# Altium schematic sheet [10]-POWER.SchDoc
size A4; Organization: Altium Limited; Address1: L3, 12a Rodborough Rd; Address2: Frenchs Forest; Address3: NSW; Address4: Australia 2086
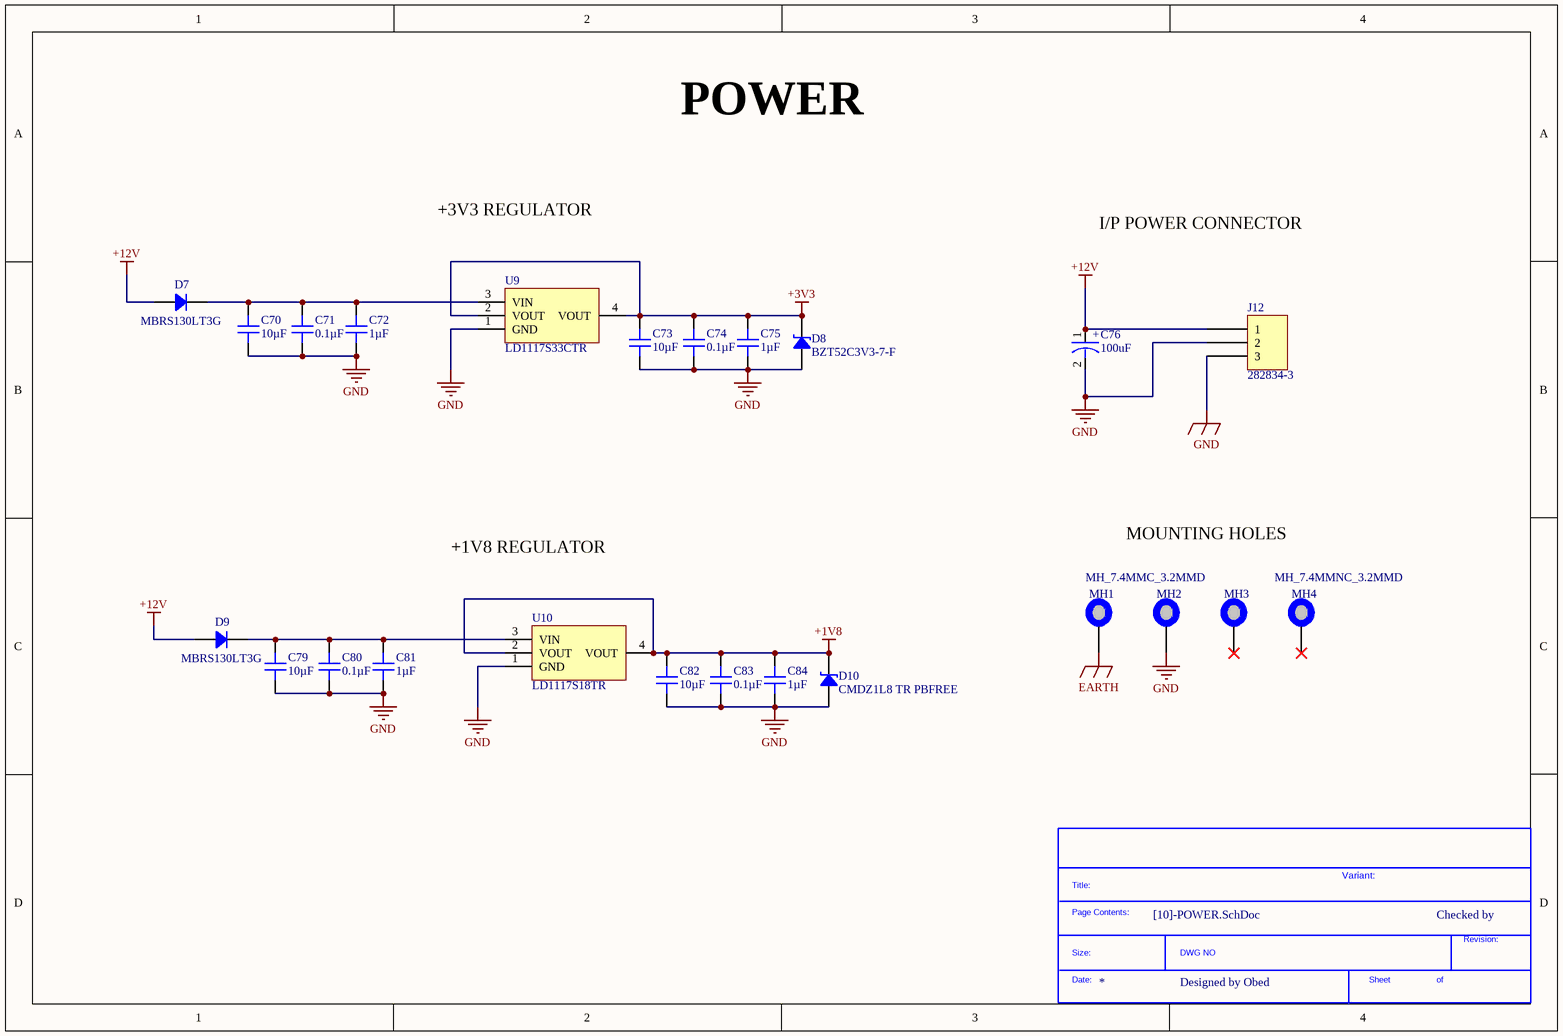
[diagram p0: [10]-POWER.SchDoc]

## Parts
*?  SDTitleBlock  (value not drawn)  (graphical)
C70  10µF  [CAP 1206_3216 - 1.8MM]
C71  0.1µF  [CAP 0805_2012]
C72  1µF  [CAP 0805_2012]
C73  10µF  [CAP 1206_3216 - 1.8MM]
C74  0.1µF  [CAP 0805_2012]
C75  1µF  [CAP 0805_2012]
C76  100uF  [ACAP_P305_D393_H393_RAD]
C79  10µF  [CAP 1206_3216 - 1.8MM]
C80  0.1µF  [CAP 0805_2012]
C81  1µF  [CAP 0805_2012]
C82  10µF  [CAP 1206_3216 - 1.8MM]
C83  0.1µF  [CAP 0805_2012]
C84  1µF  [CAP 0805_2012]
D7  MBRS130LT3G  [DO214AA SMB]
D8  BZT52C3V3-7-F  [SOD-123]
D9  MBRS130LT3G  [DO214AA SMB]
D10  CMDZ1L8 TR PBFREE  [SOD323]
J12  282834-3  [TE 282834-3]
MH1  MH_7.4MMC_3.2MMD  [MH_7.4MMC_3.2MMD]
MH2  MH_7.4MMC_3.2MMD  [MH_7.4MMC_3.2MMD]  (value not drawn)
MH3  MH_7.4MMC_3.2MMD  [MH_7.4MMC_3.2MMD]  (value not drawn)
MH4  MH_7.4MMNC_3.2MMD  [MH_7.4MM_3.2MMD_NON_COPPER_NPTH]
U9  LD1117S33CTR  [SOT223_3]
U10  LD1117S18TR  [SOT223_3]

## Nets
+1V8: C82.2 C83.1 C84.2 D10.2 U10.2(VOUT) U10.4(VOUT)
+3V3: C73.2 C74.1 C75.2 D8.2 U9.2(VOUT) U9.4(VOUT)
+12V: C76.1 D7.1 D9.1 J12.1
EARTH: MH1.1
GND: C70.1 C71.2 C72.1 C73.1 C74.2 C75.1 C76.2 C79.1 C80.2 C81.1 C82.1 C83.2 C84.1 D8.1 D10.1 J12.2 J12.3 MH2.1 U9.1(GND) U10.1(GND)
NetC70_2: C70.2 C71.1 C72.2 D7.2 U9.3(VIN)
NetC79_2: C79.2 C80.1 C81.2 D9.2 U10.3(VIN)

Not connected (* = marked no-connect by the designer): MH3 1*; MH4 1*

## Notes on the sheet
- POWER
- +3V3 REGULATOR
- I/P POWER CONNECTOR
- +1V8 REGULATOR
- MOUNTING HOLES
- Variant:
- Checked by
- Designed by Obed
- Title
- Size:
- Date:
- A4
- Number:
- Time:
- Revision:
- Sheet
- of
- File:
- (in symbol CAP-P_100uF-50V-20%-RAD) +
- (in symbol SDTitleBlock) Title:; Page Contents:; Revision:; Size:; DWG NO; Date:; Sheet; of

## Library data of the parts
C70 C73 C79 C82 = 12065D106KAT2A: CAP CER 10UF 50V X5R 1206; Manufacturer: AVX Corporation; Tolerance: ±10%; Part Number: 12065D106KAT2A; Value: 10µF; Applications: General Purpose; Capacitance: 10µF; ComponentLink1Description: Datasheet; ComponentLink1URL: http://datasheets.avx.com/cx5r.pdf; ComponentLink2Description: DigiKey Link; ComponentLink2URL: http://digikey.com/product-detail/en/avx-corporation/12065D106KAT2A/478-9979-1-ND/6149060; Device Package: 1206 (3216 Metric); LastUpdated: 02/09/2020 01:05:35; Lifecycle Status: Active; Minimum Order: 1; Mounting Type: Surface Mount, MLCC; Operating Temperature: -55°C ~ 85°C; Package / Case: 1206 (3216 Metric); Packaging: TapeAndReel; PartId: 21345; Part Status: Active; Price: 0.16; Series: -; Size / Dimension: 0.126" L x 0.063" W (3.20mm x 1.60mm); Supplier 1: DigiKey; Supplier Part Number 1: 478-9979-1-ND; Temperature Coefficient: X5R; Thickness (Max): 0.071" (1.80mm); Voltage - Rated: 50V
C71 C74 C80 C83 = 0805J0500104KXT: CAP CER 0.1UF 50V X7R 0805; Manufacturer: Knowles Syfer; Tolerance: ±10%; Part Number: 0805J0500104KXT; Value: 0.1µF; Applications: General Purpose; Capacitance: 0.1µF; ComponentLink1Description: Datasheet; ComponentLink1URL: https://www.knowlescapacitors.com/getattachment/2dbfc8bc-e2b3-4b4d-afb1-43b011b9ebe0/High-Std-Voltage.aspx; ComponentLink2Description: DigiKey Link; ComponentLink2URL: http://digikey.com/product-detail/en/knowles-syfer/0805J0500104KXT/1608-1000-1-ND/5730199; Device Package: 0805 (2012 Metric); LastUpdated: 02/09/2020 01:04:31; Lifecycle Status: Active; Minimum Order: 1; Mounting Type: Surface Mount, MLCC; Operating Temperature: -55°C ~ 125°C; Package / Case: 0805 (2012 Metric); Packaging: TapeAndReel; PartId: 8322; Part Status: Active; Price: 0.17; Series: -; Size / Dimension: 0.079" L x 0.049" W (2.00mm x 1.25mm); Supplier 1: DigiKey; Supplier Part Number 1: 1608-1000-1-ND; Temperature Coefficient: X7R; Thickness (Max): 0.051" (1.30mm); Voltage - Rated: 50V
C72 C75 C81 C84 = 0805BB105K250YT: CAP CER 1UF 25V X7R 0805; Manufacturer: Knowles Novacap; Tolerance: ±10%; Part Number: 0805BB105K250YT; Value: 1µF; Applications: General Purpose; Capacitance: 1µF; ComponentLink1Description: Datasheet; ComponentLink1URL: https://www.knowlescapacitors.com/getattachment/6c8d48ef-fc2b-4752-ae2c-ce6c208de0c4/High-Capacitance-Chip.aspx; ComponentLink2Description: DigiKey Link; ComponentLink2URL: http://digikey.com/product-detail/en/knowles-novacap/0805BB105K250YT/1763-1195-1-ND/7304292; Device Package: 0805 (2012 Metric); LastUpdated: 9/2/2020 01:04:39; Lifecycle Status: Active; Minimum Order: 1; Mounting Type: Surface Mount, MLCC; Operating Temperature: -55°C ~ 125°C; Package / Case: 0805 (2012 Metric); Packaging: TapeAndReel; PartId: 4178; Part Status: Active; Price: 0.89; Series: -; Size / Dimension: 0.080" L x 0.050" W (2.03mm x 1.27mm); Supplier 1: DigiKey; Supplier Part Number 1: 1763-1195-1-ND; Temperature Coefficient: X7R; Thickness (Max): 0.054" (1.37mm); Voltage - Rated: 25V
C76 = CAP-P_100uF-50V-20%-RAD: Cap, Aec-Q200, 100Uf, 50V, Alu Elec, Smd Rohs Compliant: Yes; Manufacturer: KEMET; Manufacturer Part Number: A768MS107M1HLAV024; Pricing 1: 2500=1.10647 (USD); Supplier 1: Digi-Key; Supplier Part Number 1: C317C622F5G5TA7301-ND
D7 D9 = MBRS130LT3G: DIODE SCHOTTKY 30V 2A SMB; Manufacturer: ON Semiconductor; Current - Reverse Leakage @ Vr: 1mA @ 30V; Speed: Fast Recovery =< 500ns, > 200mA (Io); Voltage - Forward (Vf) (Max) @ If: 445mV @ 2A; Part Number: MBRS130LT3G; ComponentLink1Description: Datasheet; ComponentLink1URL: https://www.onsemi.com/pub/Collateral/MBRS130LT3-D.PDF; ComponentLink2Description: DigiKey Link; ComponentLink2URL: http://digikey.com/product-detail/en/on-semiconductor/MBRS130LT3G/MBRS130LT3GOSCT-ND/918000; Current - Average Rectified (Io): 2A; Diode Type: Schottky; LastUpdated: 9/2/2020 01:18:53; Lifecycle Status: Active; Minimum Order: 1; Mounting Type: Surface Mount; Operating Temperature - Junction: -65°C ~ 125°C; Package / Case: DO-214AA, SMB; Packaging: TapeAndReel; PartId: 1388; Part Status: Active; Price: 0.09; Series: -; Supplier 1: DigiKey; Supplier Part Number 1: MBRS130LT3GOSCT-ND; Supplier Device Package: SMB; Voltage - DC Reverse (Vr) (Max): 30V
D8 = BZT52C3V3-7-F: DIODE ZENER 3.3V 500MW SOD123; Manufacturer: Diodes Incorporated; Current - Reverse Leakage @ Vr: 5µA @ 1V; Impedance (Max) (Zzt): 95 Ohms; Tolerance: ±6%; Voltage - Forward (Vf) (Max) @ If: 900mV @ 10mA; Part Number: BZT52C3V3-7-F; ComponentLink1Description: Datasheet; ComponentLink1URL: https://www.diodes.com/assets/Datasheets/ds18004.pdf; ComponentLink2Description: DigiKey Link; ComponentLink2URL: http://digikey.com/product-detail/en/diodes-incorporated/BZT52C3V3-7-F/BZT52C3V3-FDICT-ND/717854; LastUpdated: 9/2/2020 01:19:25; Lifecycle Status: Active; Minimum Order: 1; Mounting Type: Surface Mount; Operating Temperature: -65°C ~ 150°C; Package / Case: SOD-123; Packaging: TapeAndReel; PartId: 2214; Part Status: Active; Power - Max: 500mW; Price: 0.04; Series: -; Supplier 1: DigiKey; Supplier Part Number 1: BZT52C3V3-FDICT-ND; Supplier Device Package: SOD-123; Voltage - Zener (Nom) (Vz): 3.3V
D10 = CMDZ1L8 TR PBFREE: DIODE ZENER 1.8V 250MW SOD323; Manufacturer: Central Semiconductor Corp; Current - Reverse Leakage @ Vr: 25µA @ 1V; Impedance (Max) (Zzt): 1.2 kOhms; Tolerance: ±5%; Voltage - Forward (Vf) (Max) @ If: 900mV @ 10mA; Part Number: CMDZ1L8 TR PBFREE; ComponentLink1Description: Datasheet; ComponentLink1URL: https://my.centralsemi.com/get_document.php?cmp=1&mergetype=pd&mergepath=pd&pdf_id=CMDZ5L1-36L.PDF; ComponentLink2Description: DigiKey Link; ComponentLink2URL: http://digikey.com/product-detail/en/central-semiconductor-corp/CMDZ1L8-TR-PBFREE/1514-CMDZ1L8TRPBFREECT-ND/5324426; LastUpdated: 9/2/2020 01:27:30; Lifecycle Status: Active; Minimum Order: 1; Mounting Type: Surface Mount; Operating Temperature: -65°C ~ 150°C; Package / Case: SC-76, SOD-323; Packaging: TapeAndReel; PartId: 3515; Part Status: Active; Power - Max: 250mW; Price: 0.10; Series: -; Supplier 1: DigiKey; Supplier Part Number 1: 1514-CMDZ1L8TRPBFREECT-ND; Supplier Device Package: SOD-323; Voltage - Zener (Nom) (Vz): 1.8V
J12 = 282834-3: TERM BLK 3P SIDE ENT 2.54MM PCB; Manufacturer: TE Connectivity AMP Connectors; Current: 10A; Mating Orientation: Horizontal with Board; Number of Levels: 1; Pitch: 0.100" (2.54mm); Positions Per Level: 3; Voltage: 150V; Wire Gauge: 16-30 AWG; Wire Termination: Screw - Rising Cage Clamp; Part Number: 282834-3; Color: Green; ComponentLink1Description: Datasheet; ComponentLink1URL: https://www.te.com/commerce/DocumentDelivery/DDEController?Action=srchrtrv&DocNm=282834&DocType=Customer+Drawing&DocLang=English; ComponentLink2Description: DigiKey Link; ComponentLink2URL: http://digikey.com/product-detail/en/te-connectivity-amp-connectors/282834-3/A98334-ND/1153264; LastUpdated: 1/15/2020 04:15:50; Lifecycle Status: Active; Minimum Order: 1; Mounting Type: Through Hole; Packaging: Bulk; Part Status: Active; Price: 2.01; Series: Buchanan; Supplier 1: DigiKey; Supplier Part Number 1: A98334-ND
MH1-MH3 = MH_7.4MMC_3.2MMD: Mounting Hole 7.4mm Diameter, 3.2mm Dril
MH4 = MH_7.4MMNC_3.2MMD: Mounting Hole 7.4mm Diameter (Non Copper), 3.2mm Dril NPTH
U9 = REG_15V-3.3V-0.9A-12W-SOT223: Linear Voltage Regulator IC 1 Output 800mA SOT-223; Manufacturer: STMicroelectronics; Alternate Part Number-1: NA; Manufacturer Part Number: LD1117S33CTR; Case/Package: SOT223; Supplier-1: SP ROAD; Supplier Part Number-1: LD1117S33CTR
U10 = REG_15V-1.8V-0.8A-1.4W-SOT223: LDO Voltage Regulators 1.8V 0.8A Positive; Manufacturer: STMicroelectronics; Alternate Part Number-1: NA; Manufacturer Part Number: LD1117S18TR; Case/Package: SOT-223-3; Supplier-1: Mouser; Supplier Part Number-1: 511-LD1117S18-TR